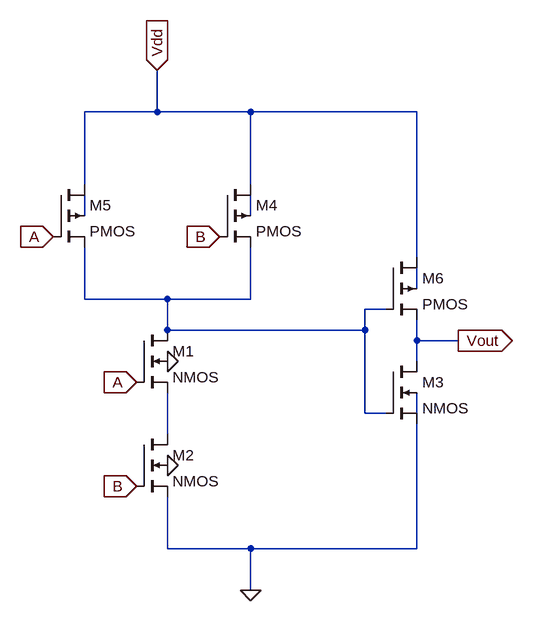
[diagram p0: schematic and2.asc]
and2.asc, the LTspice schematic file:
Version 4.1
SHEET 1 880 680
WIRE 192 -208 192 -272
WIRE 192 -208 80 -208
WIRE 336 -208 192 -208
WIRE 592 -208 336 -208
WIRE 80 -96 80 -208
WIRE 336 -96 336 -208
WIRE 80 -48 80 -80
WIRE 336 -48 336 -80
WIRE 592 16 592 -208
WIRE 592 64 592 32
WIRE 80 80 80 0
WIRE 208 80 80 80
WIRE 336 80 336 0
WIRE 336 80 208 80
WIRE 544 96 512 96
WIRE 208 128 208 80
WIRE 512 128 512 96
WIRE 512 128 208 128
WIRE 592 144 592 112
WIRE 656 144 592 144
WIRE 592 176 592 144
WIRE 512 256 512 128
WIRE 544 256 512 256
WIRE 592 256 592 224
WIRE 208 288 208 224
WIRE 208 464 208 384
WIRE 336 464 208 464
WIRE 592 464 592 272
WIRE 592 464 336 464
WIRE 336 528 336 464
FLAG 336 528 0
FLAG 32 -16 A
IOPIN 32 -16 In
FLAG 160 208 A
IOPIN 160 208 In
FLAG 160 368 B
IOPIN 160 368 In
FLAG 288 -16 B
IOPIN 288 -16 In
FLAG 656 144 Vout
IOPIN 656 144 Out
FLAG 208 336 0
FLAG 208 176 0
FLAG 192 -272 Vdd
IOPIN 192 -272 In
SYMBOL nmos4 160 128 R0
SYMATTR InstName M1
SYMATTR Value2 l=180n w=800n
SYMBOL nmos4 160 288 R0
SYMATTR InstName M2
SYMATTR Value2 l=180n w=800n
SYMBOL nmos4 544 176 R0
SYMATTR InstName M3
SYMATTR Value2 l=180n w=400n
SYMBOL pmos4 288 -96 R0
SYMATTR InstName M4
SYMATTR Value2 l=180n w=800n
SYMBOL pmos4 32 -96 R0
SYMATTR InstName M5
SYMATTR Value2 l=180n w=800n
SYMBOL pmos4 544 16 R0
SYMATTR InstName M6
SYMATTR Value2 l=180n w=800n

The netlist it stands for:
* and2.asc
M1 N004 A N006 0 NMOS l=180n w=800n
M2 N006 B 0 0 NMOS l=180n w=800n
M3 Vout N004 0 N005 NMOS l=180n w=400n
M4 Vdd B N004 N002 PMOS l=180n w=800n
M5 Vdd A N004 N001 PMOS l=180n w=800n
M6 Vdd N004 Vout N003 PMOS l=180n w=800n
.model NMOS NMOS
.model PMOS PMOS
.lib standard.mos
.backanno
.end